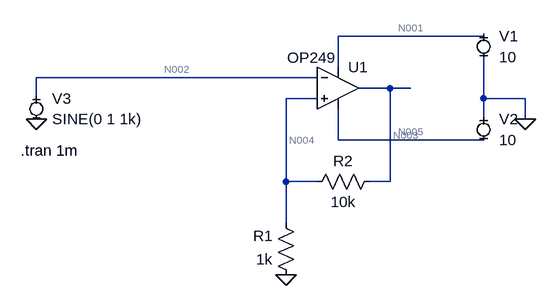
[diagram p0: schematic 3_тригер шмідта.asc]
* 3_тригер шмідта.asc
* U1: OP249 (symbol EXTRA\AudioOpamp\AD\OP249 not available, pins judged from their places): In+=N004 In-=N002 V+=N001 V-=N005 OUT=N003
V1 N001 0 10
V2 0 N005 10
R2 N004 N003 10k
R1 0 N004 1k
V3 N002 0 SINE(0 1 1k)
.tran 1m
.backanno
.end

* Results of the author's LTspice run, read from the files saved beside the schematic
* Operating Point, zero values left out:
*   V(n004) = 710.3 mV
*   V(n005) = -10 V
*   V(n001) = 10 V
*   V(n003) = 7.813 V
*   I(R1) = -710.3 µA
*   I(R2) = -710.3 µA
*   I(V3) = -66.76 pA
*   I(V2) = -1.603 mA
*   I(V1) = -2.313 mA
*   Ix(u1:1) = 76.2 pA
*   Ix(u1:2) = 66.76 pA
*   Ix(u1:99) = 2.314 mA
*   Ix(u1:50) = -1.604 mA
*   Ix(u1:30) = -710.3 µA
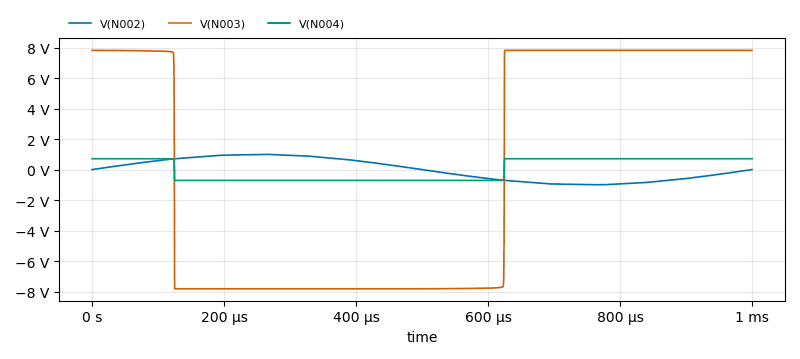
[diagram p1: Transient Analysis of 3_тригер шмідта.asc, plotted from the saved traces]
* Transient Analysis, 1 run:
*   V(N002): min -994.7 mV, max 994.1 mV, average -315.6 µV, rms 702 mV, last 0 V
*   V(N003): min -7.816 V, max 7.816 V, average 1.448 mV, rms 7.803 V, last 7.813 V
*   V(N004): min -710.5 mV, max 710.5 mV, average 131.6 µV, rms 709.3 mV, last 710.3 mV